# EAGLE design Grilo (EAGLE 7.2.0)
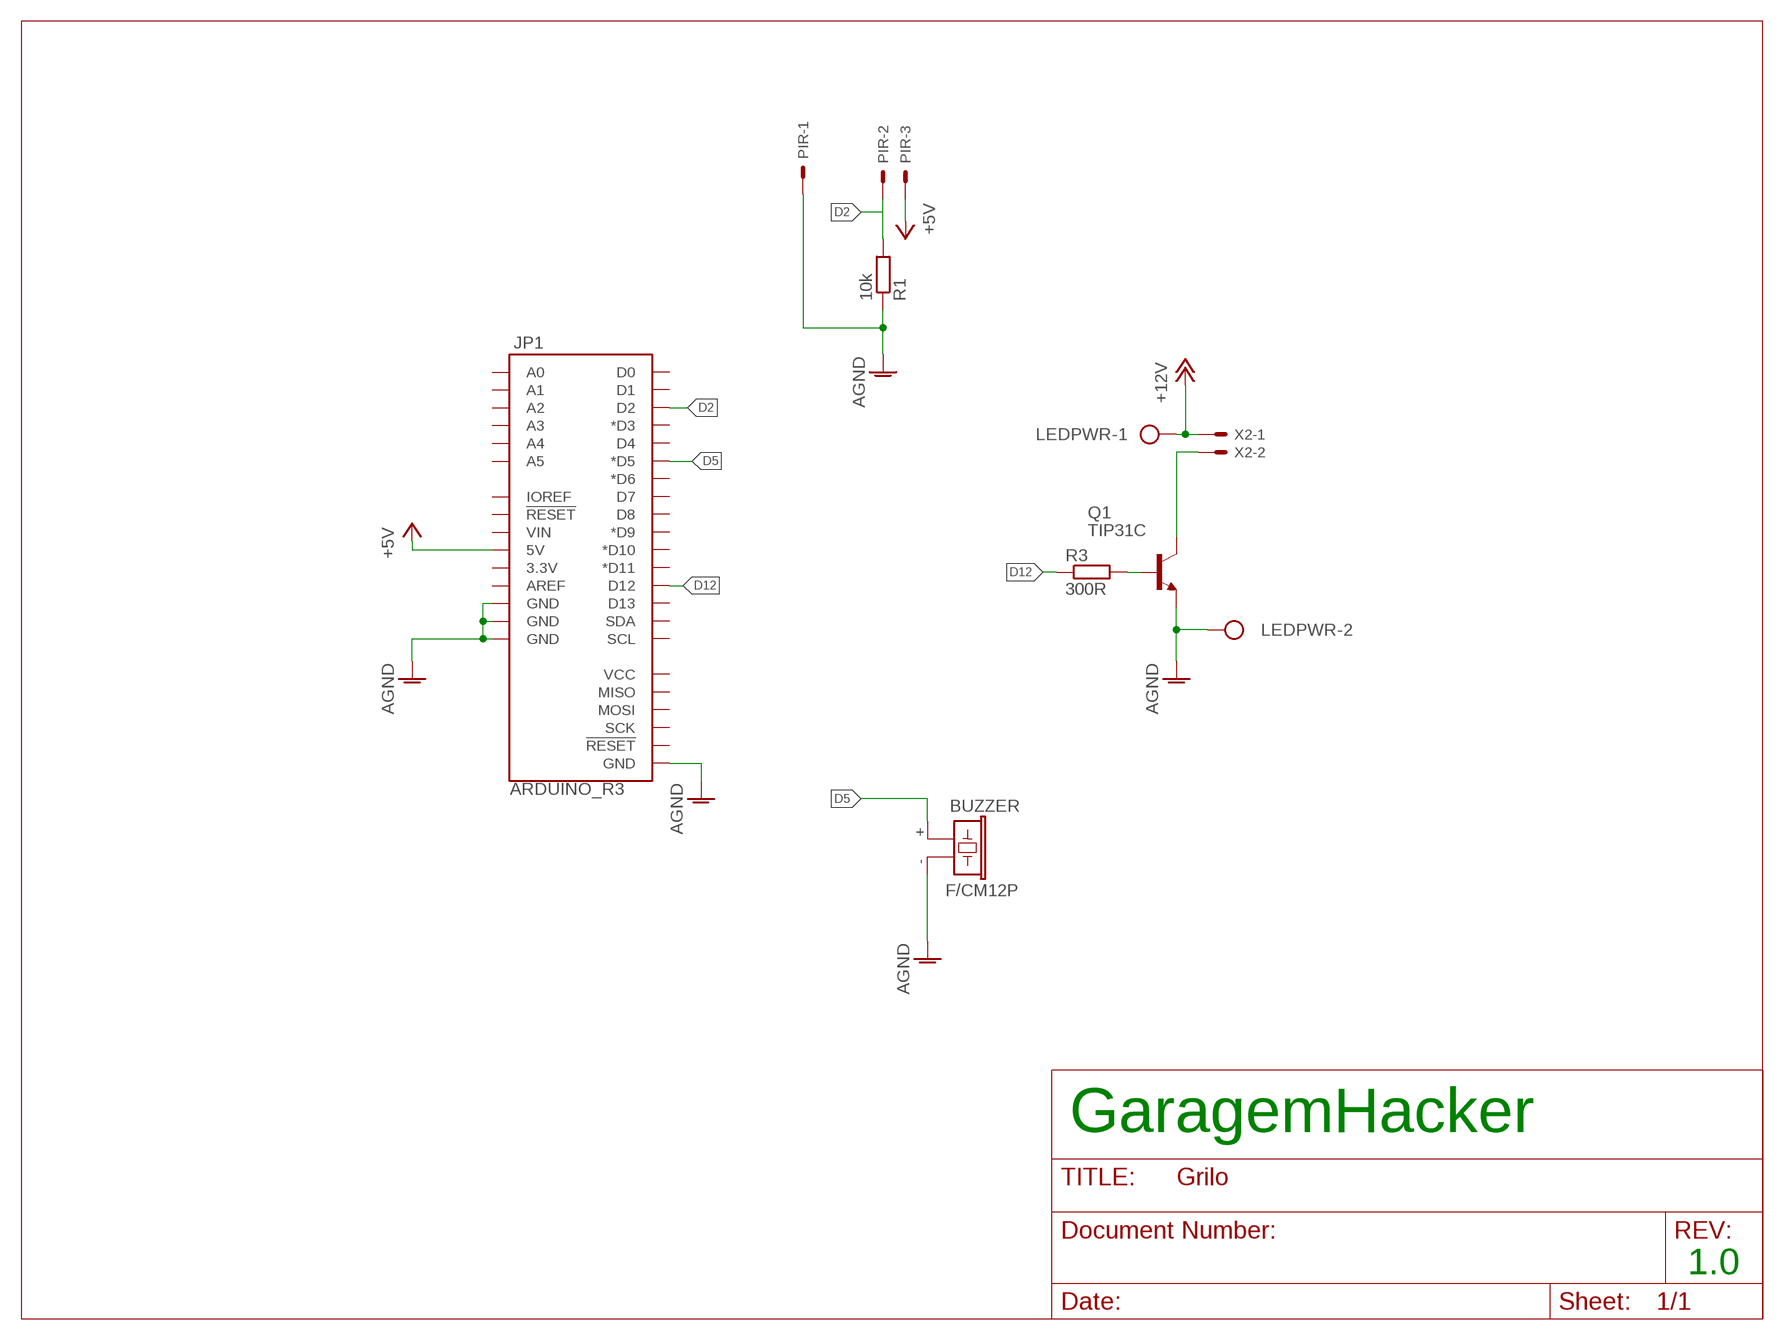
[diagram p0: schematic, sheet 1]

## Parts
BUZZER  F/CM12P  [F/CM12P]
JP1  ARDUINO_R3  [ARDUINO_R3]
LEDPWR  AK500/2  [AK500/2]
PIR  KK-156-3  [KK-156-3]
Q1  TIP31C  [TO220V]
R1  10k  R-EU_0207/10  [0207/10]
R3  300R  R-EU_0207/10  [0207/10]
X2  KK-156-2  [KK-156-2]

## Nets
+5V: JP1.5V PIR.3
+12V: LEDPWR.1 X2.1
AGND: BUZZER.- JP1.GND@1(GND) JP1.GND@2(GND) JP1.GND@3(GND) JP1.GND@4(GND) LEDPWR.2 PIR.1 Q1.3(E) R1.1
D2: JP1.D2 PIR.2 R1.2
D5: BUZZER.+ JP1.D5(*D5)
D12: JP1.D12 R3.1
N$1: Q1.1(B) R3.2
N$2: Q1.2(C) X2.2
Unconnected: JP1.3.3V JP1.A0 JP1.A1 JP1.A2 JP1.A3 JP1.A4 JP1.A5 JP1.AREF JP1.D0 JP1.D1 JP1.D3(*D3) JP1.D4 JP1.D6(*D6) JP1.D7 JP1.D8 JP1.D9(*D9) JP1.D10(*D10) JP1.D11(*D11) JP1.D13 JP1.IOREF JP1.MISO JP1.MOSI JP1.RESET@1(!RESET!) JP1.RESET@2(!RESET!) JP1.SCK JP1.SCL JP1.SDA JP1.VCC JP1.VIN

## Notes on the sheet
- GaragemHacker
- 1.0

## Library data of the parts
BUZZER = buzzer:F/CM12P: BUZZER Source: Buerklin; OC_FARNELL: unknown; OC_NEWARK: unknown
JP1 = SparkFun-Boards:ARDUINO_R3: Arduino R3 Footprint (w/ SPI header)
LEDPWR = con-ptr500:AK500/2: CONNECTOR; OC_FARNELL: unknown; OC_NEWARK: unknown
PIR = con-molex:KK-156-3: KK 156 HEADER Source: http://www.molex.com/pdm_docs/sd/026604100_sd.pdf; OC_FARNELL: unknown; OC_NEWARK: unknown
Q1 = transistor-npn:TIP31C*: NPN Transistor
R1 R3 = resistor:R-EU_: RESISTOR, European symbol
X2 = con-molex:KK-156-2: KK 156 HEADER Source: http://www.molex.com/pdm_docs/sd/026604100_sd.pdf; OC_FARNELL: unknown; OC_NEWARK: unknown

## Board
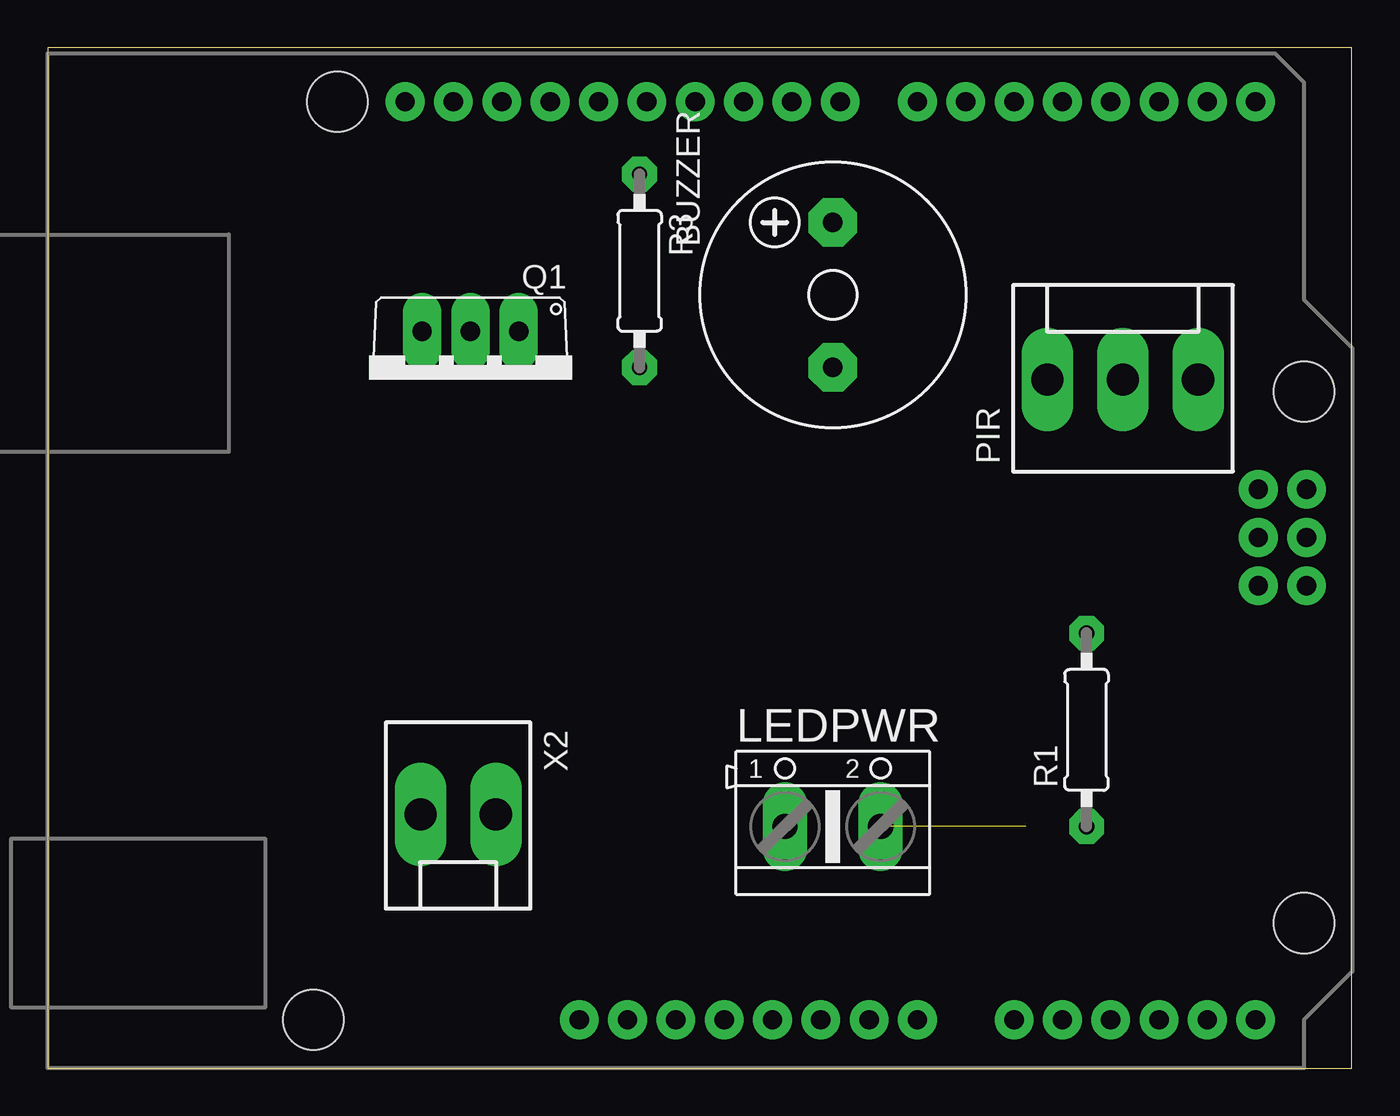
[diagram p1: board, top side]
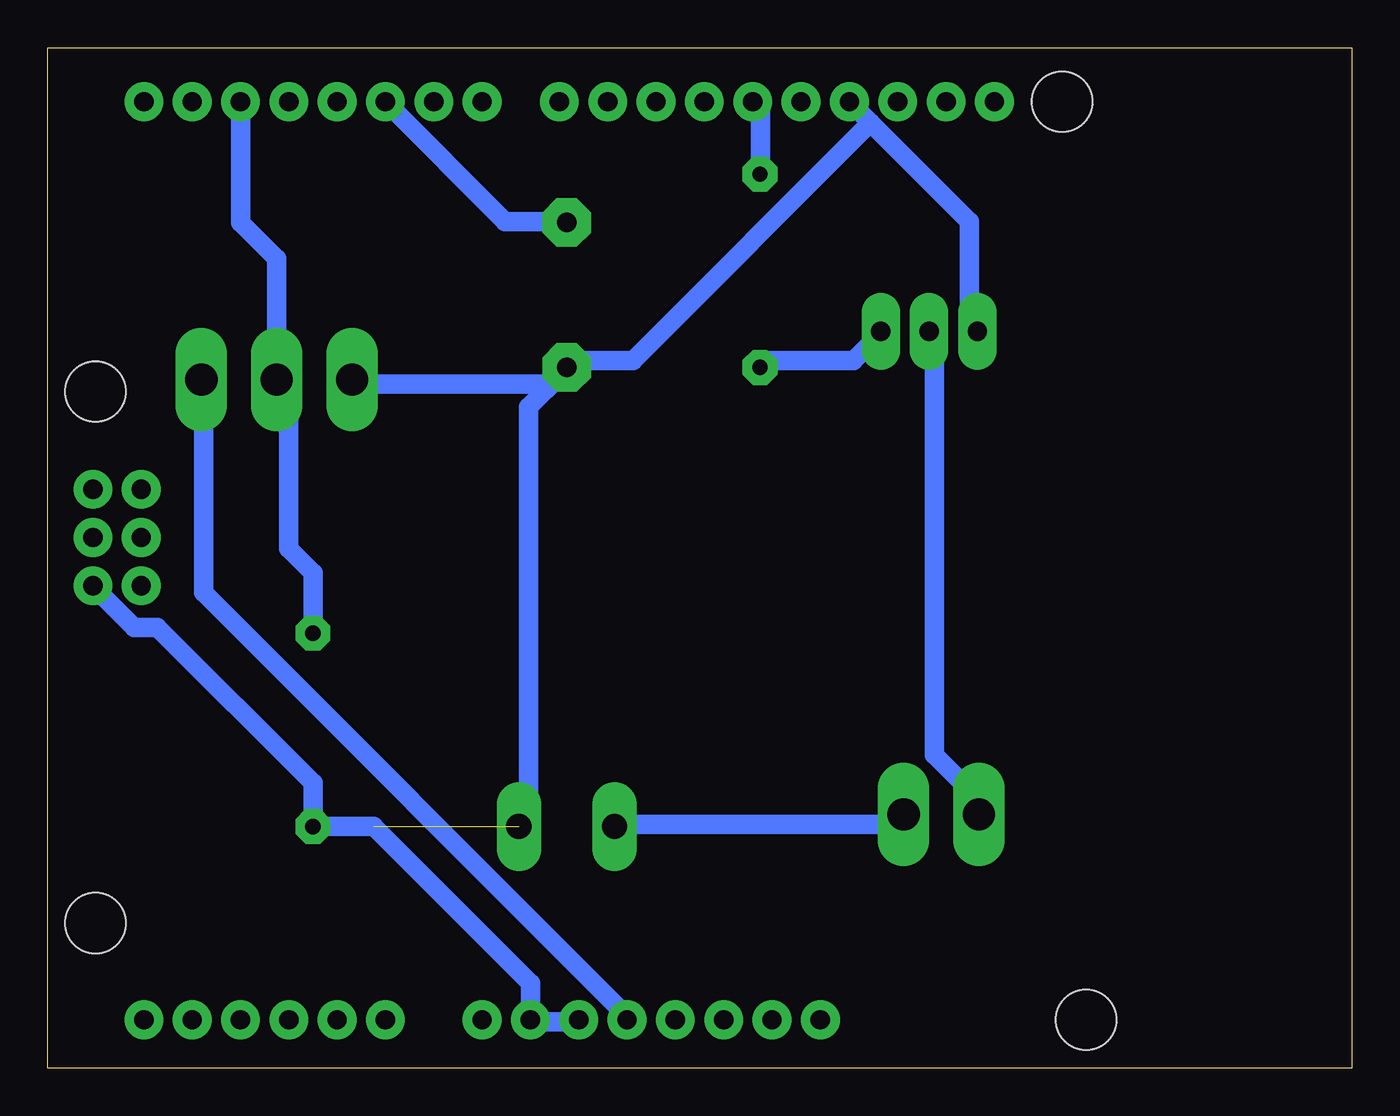
[diagram p2: board, bottom side, seen from below]

Size 68.56 x 53.65 mm. Coordinates in mm from the lower left corner, seen from the top.
Outline: 0,0 68.56,0 68.56,53.65 0,53.65 0,0
Copper layers (1*16): Top 0.035mm / dielectric 1.5mm / Bottom 0.035mm
Design rules "default": minimum track width 40mil, minimum drill 40mil, track to track 8mil, track to pad 8mil, pad to pad 8mil, via to via 8mil, smd to smd 8mil, copper to edge 40mil, drill to drill 8mil, minimum pad ring 20mil, minimum via ring 20mil, stop-mask expansion 4mil, vias tented up to drill 0mil, thermal gap 40mil

### Footprints (pad centres in the part's own frame; a part is rotated, then mirrored left to right if it is on the bottom)
F/CM12P = drill 1.016 pad 2.54 octagon: + 3.81,0; - -3.81,0
ARDUINO_R3 = drill 1.016 pad 1.93: 3.3V 35.56,2.54; 5V 38.1,2.54; A0 50.8,2.54; A1 53.34,2.54; A2 55.88,2.54; A3 58.42,2.54; A4 60.96,2.54; A5 63.5,2.54; AREF 23.876,50.8; D0 63.5,50.8; D1 60.96,50.8; D2 58.42,50.8; D3 55.88,50.8; D4 53.34,50.8; D5 50.8,50.8; D6 48.26,50.8; D7 45.72,50.8; D8 41.656,50.8; D9 39.116,50.8; D10 36.576,50.8; D11 34.036,50.8; D12 31.496,50.8; D13 28.956,50.8; GND@1 40.64,2.54; GND@2 43.18,2.54; GND@3 26.416,50.8; GND@4 66.18,25.35; IOREF 30.48,2.54; MISO 63.64,30.43; MOSI 66.18,27.89; NC 27.94,2.54; RESET@1 33.02,2.54; RESET@2 63.64,25.35; SCK 63.64,27.89; SCL 18.796,50.8; SDA 21.336,50.8; VCC 66.18,30.43; VIN 45.72,2.54 | hole 3.175: 15.24,50.8; 66.04,35.56; 66.04,7.62; 13.97,2.54
AK500/2 = drill 1.321 long: 1 -2.515,0; 2 2.515,0
KK-156-3 = drill 1.7 pad 2.184 long: 1 -3.96,0; 2 0,0; 3 3.96,0
TO220V = drill 1.016 long: 1 -2.54,-2.54; 2 0,-2.54; 3 2.54,-2.54
0207/10 = drill 0.813 octagon: 1 -5.08,0; 2 5.08,0
KK-156-2 = drill 1.7 pad 2.184 long: 1 -1.98,0; 2 1.98,0

### Placement (x,y rotation side)
BUZZER  41.27,40.64 90 top
JP1  0,0 0 top
LEDPWR  41.27,12.7 0 top
PIR  56.52,36.2 0 top
Q1  22.23,36.2 180 top
R1  54.61,17.78 90 top
R3  31.11,41.91 270 top
X2  21.59,13.34 180 top

### Tracks (layer width: path | path; a pad name or v marks a point on that pad's centre or on a via)
+5V
  Bottom 1.016: JP1.5V 38.41,3.05 60.35,24.99 60.35,35.97 PIR.3
+12V
  Bottom 1.016: LEDPWR.1 38.41,12.8 23.77,12.8 X2.1
AGND  (1 unrouted)
  Bottom 1.016: JP1.GND@3 25.3,49.68 | 25.3,49.68 20.12,44.5 20.12,39.01 Q1.3 | 42.37,35.66 41.45,36.58 BUZZER.- 40.84,37.19 37.8,37.19 25.3,49.68 | 42.37,35.66 43.28,34.75 43.28,12.8 LEDPWR.2 | PIR.1 52.43,35.97 42.67,35.97 42.37,35.66 | JP1.GND@1 40.84,2.44 42.67,2.44 JP1.GND@2 43.18,4.45 51.44,12.7 R1.1 54.61,14.99 62.79,23.16 64.01,23.16 65.84,24.99 JP1.GND@4
D2
  Bottom 1.016: JP1.D2 58.42,44.45 56.52,42.55 PIR.2 55.88,35.56 55.88,27.3 54.61,26.04 R1.2
D5
  Bottom 1.016: JP1.D5 44.5,44.5 41.45,44.5 BUZZER.+
D12
  Bottom 1.016: R3.1 31.09,47.55 31.09,50.6 JP1.D12
N$1
  Bottom 1.016: R3.2 31.09,37.19 26.21,37.19 24.99,38.41 Q1.1
N$2
  Bottom 1.016: Q1.2 21.95,38.41 21.95,16.46 20.12,14.63 20.12,13.41 X2.2